# Altium schematic sheet LM2596_BuckConverter.SchDoc
size A4
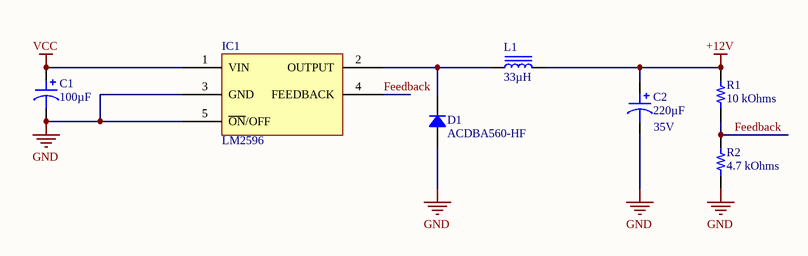
[diagram p0: LM2596_BuckConverter.SchDoc]

## Parts
C1  100µF  [CAP TH ALUM ELEC D8.00mm S3.50mm H12.50mm]
C2  220µF  Voltage - Rated: 35V  [CAP TH ALUM ELEC D8.00mm S3.50mm H12.50mm]
D1  ACDBA560-HF  [DO214AC SMA]
IC1  LM2596  [D2PAK]
L1  33µH  [BOURNS SRR1280]
R1  10 kOhms  [RES 0805_2012]
R2  4.7 kOhms  [RES 0805_2012]

## Nets
+12V: C2.1 L1.2 R1.2
GND: C1.2 C2.2 D1.1 IC1.3(GND) IC1.5(~{ON}/OFF) R2.2
VCC: C1.1 IC1.1(VIN)
Feedback: IC1.4(FEEDBACK) R1.1 R2.1
NetD1_2: D1.2 IC1.2(OUTPUT) L1.1

## Library data of the parts
C1 = ECA-1JM101: CAP ALUM 100UF 20% 63V RADIAL; Manufacturer: Panasonic Electronic Components; Lifetime @ Temp.: 2000 Hrs @ 85°C; Polarization: Polar; Ripple Current @ High Frequency: 459mA @ 10kHz; Ripple Current @ Low Frequency: 270mA @ 120Hz; Part Number: ECA-1JM101; Applications: General Purpose; Capacitance: 100µF; ComponentLink1Description: Datasheet; ComponentLink1URL: //media.digikey.com/pdf/Data%20Sheets/Panasonic%20Electronic%20Components/ECA-xxM%20Series,TypeA.pdf; ComponentLink2Description: DigiKey Link; ComponentLink2URL: http://digikey.com/product-detail/en/panasonic-electronic-components/ECA-1JM101/P5193-ND/245052; Device Package: Radial, Can; Height - Seated (Max): 0.492" (12.50mm); LastUpdated: 7.09.2020 05:24:51; Lead Spacing: 0.138" (3.50mm); Lifecycle Status: Active; Minimum Order: 1; Mounting Type: Through Hole; Operating Temperature: -40°C ~ 85°C; Package / Case: Radial, Can; Packaging: Bulk; PartId: 7225; Part Status: Active; Price: 0.37; Series: M; Size / Dimension: 0.315" Dia (8.00mm); Supplier 1: DigiKey; Supplier Part Number 1: P5193-ND; Tolerance: ±20%; Value: 100µF; Voltage - Rated: 63V
C2 = ECA-1VM221: CAP ALUM 220UF 20% 35V RADIAL; Manufacturer: Panasonic Electronic Components; Lifetime @ Temp.: 2000 Hrs @ 85°C; Polarization: Polar; Ripple Current @ High Frequency: 595mA @ 10kHz; Ripple Current @ Low Frequency: 350mA @ 120Hz; Part Number: ECA-1VM221; Applications: General Purpose; Capacitance: 220µF; ComponentLink1Description: Datasheet; ComponentLink1URL: //media.digikey.com/pdf/Data%20Sheets/Panasonic%20Electronic%20Components/ECA-xxM%20Series,TypeA.pdf; ComponentLink2Description: DigiKey Link; ComponentLink2URL: http://digikey.com/product-detail/en/panasonic-electronic-components/ECA-1VM221/P5166-ND/245025; Device Package: Radial, Can; Height - Seated (Max): 0.492" (12.50mm); LastUpdated: 7.09.2020 05:24:51; Lead Spacing: 0.138" (3.50mm); Lifecycle Status: Active; Minimum Order: 1; Mounting Type: Through Hole; Operating Temperature: -40°C ~ 85°C; Package / Case: Radial, Can; Packaging: Bulk; PartId: 7280; Part Status: Active; Price: 0.31; Series: M; Size / Dimension: 0.315" Dia (8.00mm); Supplier 1: DigiKey; Supplier Part Number 1: P5166-ND; Tolerance: ±20%; Value: 220µF
D1 = ACDBA560-HF: DIODE SCHOTTKY 60V 5A DO214AC; Manufacturer: Comchip Technology; Capacitance @ Vr, F: 250pF @ 4V, 1MHz; Current - Average Rectified (Io): 5A (DC); Current - Reverse Leakage @ Vr: 500µA @ 60V; Speed: Fast Recovery =< 500ns, > 200mA (Io); Voltage - Forward (Vf) (Max) @ If: 700mV @ 5A; Part Number: ACDBA560-HF; ComponentLink1Description: Datasheet; ComponentLink1URL: http://www.comchiptech.com/admin/files/product/ACDBA560-HF%20RevA201382.pdf; ComponentLink2Description: DigiKey Link; ComponentLink2URL: http://digikey.com/product-detail/en/comchip-technology/ACDBA560-HF/641-2078-1-ND/10131664; Diode Type: Schottky; LastUpdated: 2.09.2020 01:19:04; Lifecycle Status: Active; Minimum Order: 1; Mounting Type: Surface Mount; Operating Temperature - Junction: -55°C ~ 125°C; Package / Case: DO-214AC, SMA; Packaging: TapeAndReel; PartId: 1832; Part Status: Active; Price: 0.13; Series: Automotive, AEC-Q101; Supplier 1: DigiKey; Supplier Part Number 1: 641-2078-1-ND; Supplier Device Package: DO-214AC (SMA); Voltage - DC Reverse (Vr) (Max): 60V
L1 = SRR1280-330M: FIXED IND 33UH 3.5A 57 MOHM SMD; Manufacturer: Bourns Inc.; Current - Saturation: 3.3A; DC Resistance (DCR): 57mOhm Max; Frequency - Self Resonant: 9.5MHz; Inductance Frequency - Test: 100kHz; Material - Core: Ferrite; Q @ Freq: 28 @ 2.52MHz; Shielding: Shielded; Tolerance: ±20%; Type: Wirewound; Part Number: SRR1280-330M; ComponentLink1Description: Datasheet; ComponentLink1URL: https://www.bourns.com/docs/Product-Datasheets/SRR1280.pdf; ComponentLink2Description: DigiKey Link; ComponentLink2URL: http://digikey.com/product-detail/en/bourns-inc/SRR1280-330M/SRR1280-330MCT-ND/2127440; Current Rating (Amps): 3.5A; Device Package: Nonstandard; Height - Seated (Max): 0.315" (8.00mm); Inductance: 33µH; LastUpdated: 2.09.2020 01:22:09; Lifecycle Status: Active; Minimum Order: 1; Mounting Type: Surface Mount; Operating Temperature: -40°C ~ 125°C; Package / Case: Nonstandard; Packaging: TapeAndReel; PartId: 25; Part Status: Active; Price: 0.65; Series: SRR1280; Size / Dimension: 0.492" L x 0.492" W (12.50mm x 12.50mm); Supplier 1: DigiKey; Supplier Part Number 1: SRR1280-330MCT-ND; Value: 33µH
R1 = CRGP0805F10K: CRGP 0805 10K 1%; Manufacturer: TE Connectivity Passive Product; Power (Watts): 0.333W, 1/3W; Temperature Coefficient: ±100ppm/°C; Part Number: CRGP0805F10K; Value: 10 kOhms; ComponentLink1Description: Datasheet; ComponentLink1URL: https://www.te.com/commerce/DocumentDelivery/DDEController?Action=srchrtrv&DocNm=9-1773463-9&DocType=DS&DocLang=English; ComponentLink2Description: DigiKey Link; ComponentLink2URL: http://digikey.com/product-detail/en/te-connectivity-passive-product/CRGP0805F10K/A130489CT-ND/8578321; Composition: Thick Film; Device Package: 0805 (2012 Metric); Features: Pulse Withstanding; Height - Seated (Max): 0.026" (0.65mm); LastUpdated: 2.09.2020 01:14:53; Lifecycle Status: Active; Minimum Order: 1; Number of Terminations: 2; Operating Temperature: -55°C ~ 155°C; Package / Case: 0805 (2012 Metric); Packaging: TapeAndReel; PartId: 41700; Part Status: Active; Price: 0.02; Resistance: 10 kOhms; Series: CRGP; Size / Dimension: 0.079" L x 0.049" W (2.00mm x 1.25mm); Supplier 1: DigiKey; Supplier Part Number 1: A130489CT-ND; Supplier Device Package: 0805; Tolerance: ±1%
R2 = CRGP0805F4K7: CRGP 0805 4K7 1%; Manufacturer: TE Connectivity Passive Product; Power (Watts): 0.333W, 1/3W; Temperature Coefficient: ±100ppm/°C; Part Number: CRGP0805F4K7; Value: 4.7 kOhms; ComponentLink1Description: Datasheet; ComponentLink1URL: https://www.te.com/commerce/DocumentDelivery/DDEController?Action=srchrtrv&DocNm=9-1773463-9&DocType=DS&DocLang=English; ComponentLink2Description: DigiKey Link; ComponentLink2URL: http://digikey.com/product-detail/en/te-connectivity-passive-product/CRGP0805F4K7/A130485CT-ND/8578317; Composition: Thick Film; Device Package: 0805 (2012 Metric); Features: Pulse Withstanding; Height - Seated (Max): 0.026" (0.65mm); LastUpdated: 2.09.2020 01:15:22; Lifecycle Status: Active; Minimum Order: 1; Number of Terminations: 2; Operating Temperature: -55°C ~ 155°C; Package / Case: 0805 (2012 Metric); Packaging: TapeAndReel; PartId: 28726; Part Status: Active; Price: 0.02; Resistance: 4.7 kOhms; Series: CRGP; Size / Dimension: 0.079" L x 0.049" W (2.00mm x 1.25mm); Supplier 1: DigiKey; Supplier Part Number 1: A130485CT-ND; Supplier Device Package: 0805; Tolerance: ±1%